# EAGLE design Programmer (EAGLE 7.1.0)
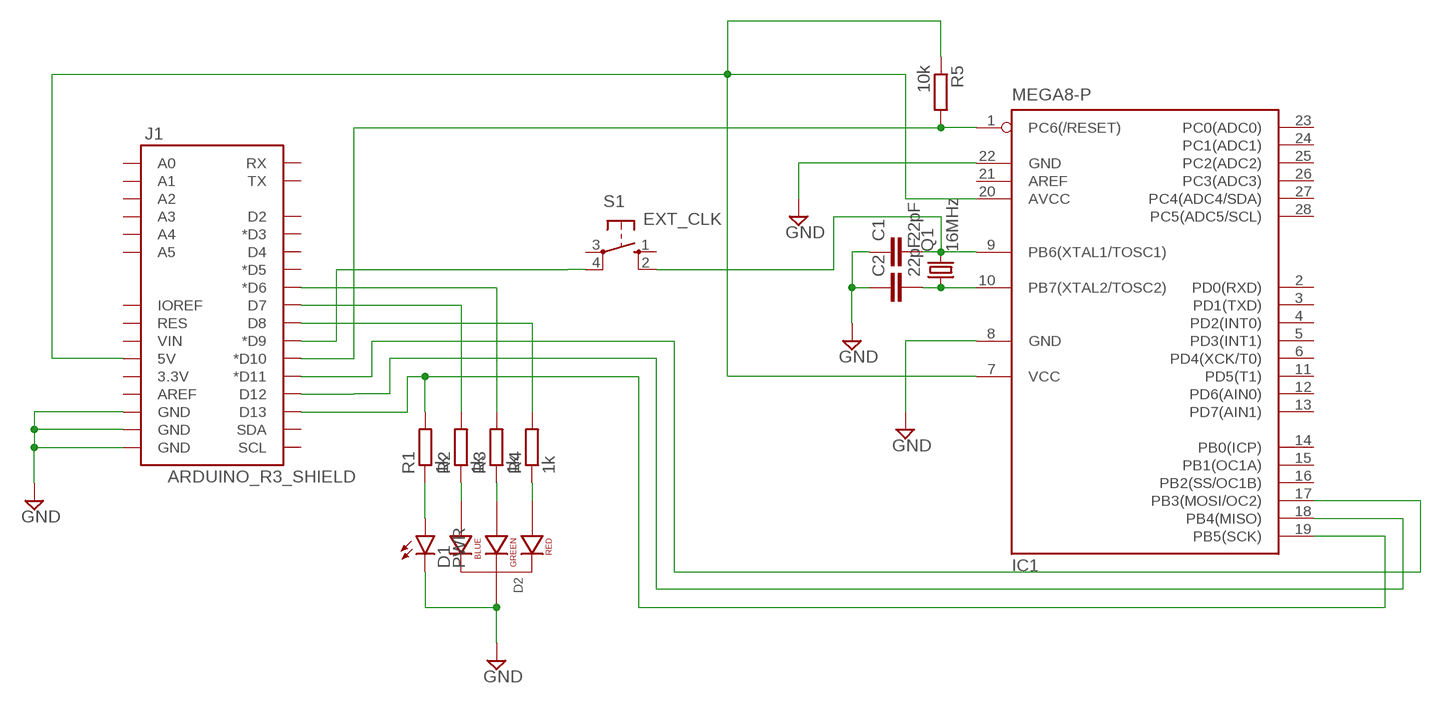
[diagram p0: schematic, sheet 1]

## Parts
C1  22pF  C5/2.5  [C5B2.5]
C2  22pF  C5/2.5  [C5B2.5]
D1  PWR  LED3MM  [LED3MM]
D2  LED-RGB-CC-THRUCLEAR  [LED-RGB-THRU]
IC1  MEGA8-P  [DIL28-3]
J1  ARDUINO_R3_SHIELD  [UNO_R3_SHIELD]
Q1  16MHz  CRYSTALHC49S  [HC49/S]
R1  1k  R-EU_0207_2V  [0207/2V]
R2  1k  R-EU_0207_2V  [0207/2V]
R3  1k  R-EU_0207_2V  [0207/2V]
R4  1k  R-EU_0207_2V  [0207/2V]
R5  10k  R-EU_0207_2V  [0207/2V]
S1  EXT_CLK  10-XX  [B3F-10XX]

## Nets
GND: C1.1 C2.1 D1.K(C) D2.2(CATHODE) IC1.8(GND) IC1.22(GND) J1.GND@0(GND) J1.GND@1(GND) J1.GND@2(GND)
N$1: C1.2 IC1.9(PB6(XTAL1/TOSC1)) Q1.2 S1.2(S1)
N$2: D2.1(RED_CATHODE) R4.1
N$3: C2.2 IC1.10(PB7(XTAL2/TOSC2)) Q1.1
N$4: D1.A R1.1
N$5: D2.4(BLUE_CATHODE) R2.1
N$6: D2.3(GREEN_CATHODE) R3.1
N$7: J1.D6(*D6) R3.2
N$8: J1.D8 R4.2
N$9: J1.D7 R2.2
N$10: IC1.19(PB5(SCK)) J1.D13 R1.2
N$15: IC1.1(PC6(/RESET)) J1.D10(*D10) R5.2
N$18: IC1.18(PB4(MISO)) J1.D12
N$20: IC1.17(PB3(MOSI/OC2)) J1.D11(*D11)
N$21: J1.D9(*D9) S1.4(P1)
VCC: IC1.7(VCC) IC1.20(AVCC) J1.5V R5.1
Unconnected: IC1.2(PD0(RXD)) IC1.3(PD1(TXD)) IC1.4(PD2(INT0)) IC1.5(PD3(INT1)) IC1.6(PD4(XCK/T0)) IC1.11(PD5(T1)) IC1.12(PD6(AIN0)) IC1.13(PD7(AIN1)) IC1.14(PB0(ICP)) IC1.15(PB1(OC1A)) IC1.16(PB2(SS/OC1B)) IC1.21(AREF) IC1.23(PC0(ADC0)) IC1.24(PC1(ADC1)) IC1.25(PC2(ADC2)) IC1.26(PC3(ADC3)) IC1.27(PC4(ADC4/SDA)) IC1.28(PC5(ADC5/SCL)) J1.3.3V J1.A0 J1.A1 J1.A2 J1.A3 J1.A4 J1.A5 J1.AREF J1.D2 J1.D3(*D3) J1.D4 J1.D5(*D5) J1.IOREF J1.RES J1.RX J1.SCL J1.SDA J1.TX J1.VIN S1.1(S) S1.3(P)

## Library data of the parts
C1 C2 = capacitor-wima:C: CAPACITOR naming: grid - package width
D1 = SparkFun-LED:LED: LEDs Standard schematic elements and footprints for 5mm, 3mm, 1206, and 0603 sized LEDs. 5mm - Spark Fun Electronics SKU : COM-00529 (and others)
D2 = SparkFun-LED:LED-RGB-CC-THRU: RGB Through-hole common cathode LED SparkFun Storefront: COM-00105 (Clear) COM-09264 (Diffuse); PROD_ID: DIO-08418
IC1 = atmel:MEGA8-P: MICROCONTROLLER 8 Kbytes FLASH, 1 kbytes SRAM, 512 bytes EEPROM, USART, 4-channel 10 bit ADC, 2-channel 8 bit ADC Pin compatible with Atmega48, ATMega88, ATMega168 Source: avr.lbr; OC_FARNELL: unknown; OC_NEWARK: unknown
J1 = SparkFun-Boards:ARDUINO_R3_SHIELD: Shield form compatible with the Arduino Uno R3.
Q1 = crystal:CRYSTAL: CRYSTAL; OC_FARNELL: 1667008; OC_NEWARK: unknown
R1-R5 = resistor:R-EU_: RESISTOR, European symbol; SPICEPREFIX: R
S1 = switch-omron:10-XX: OMRON SWITCH; MPN: B3F-1000; OC_FARNELL: 176432; OC_NEWARK: 36M3542

## Board
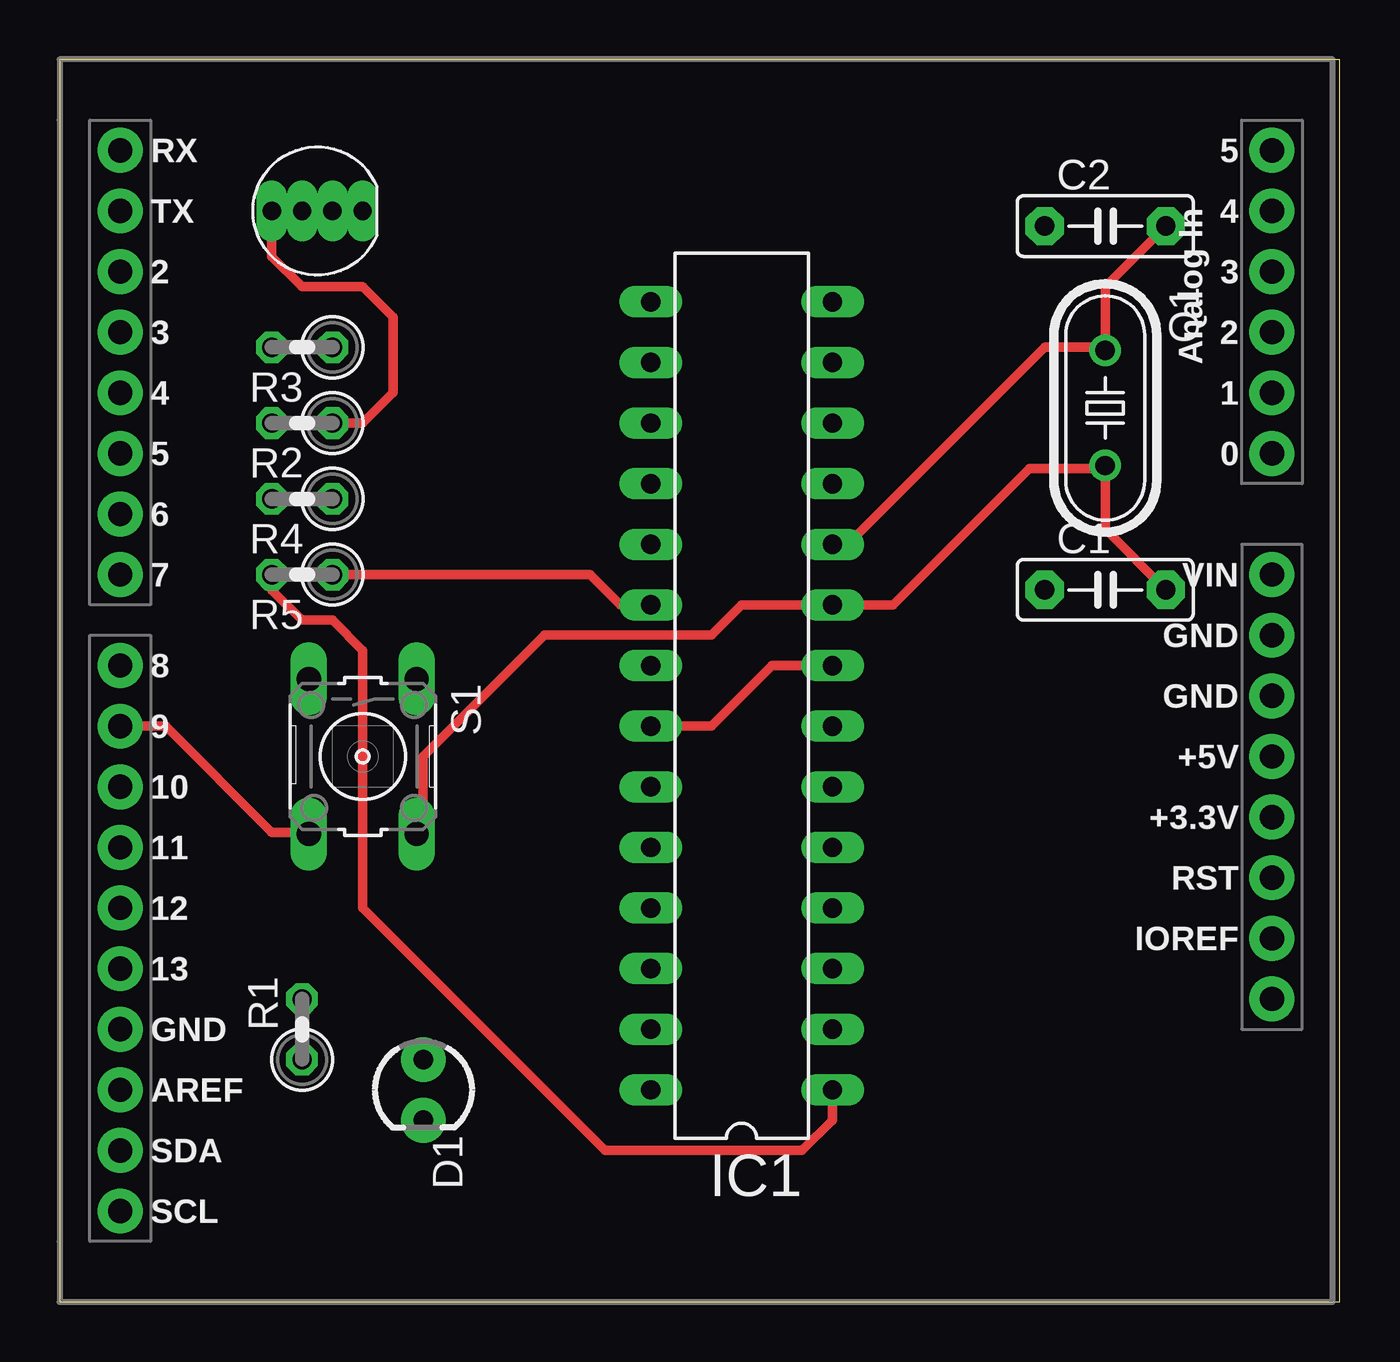
[diagram p1: board, top side]
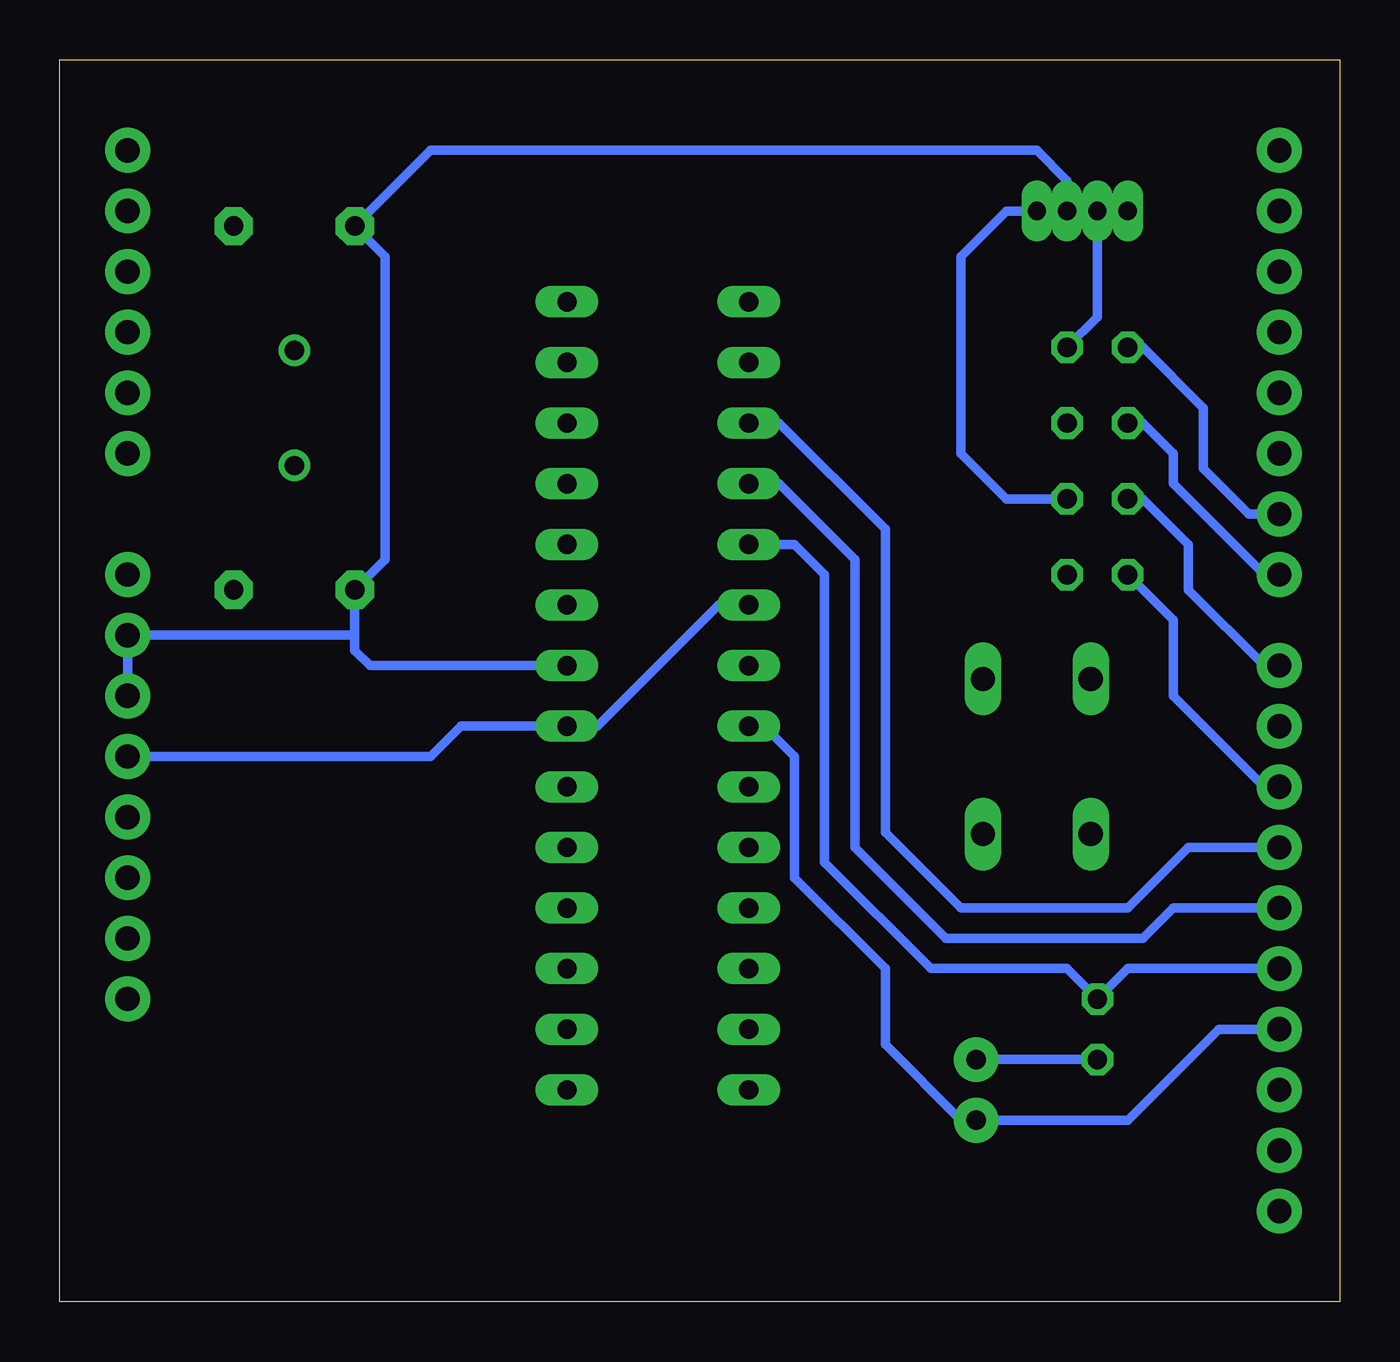
[diagram p2: board, bottom side, seen from below]

Size 53.65 x 52.06 mm. Coordinates in mm from the lower left corner, seen from the top.
Outline: 0,0 53.65,0 53.65,52.06 0,52.06 0,0
Copper layers (1*16): Top 0.035mm / dielectric 1.5mm / Bottom 0.035mm
Design rules "default": minimum track width 10mil, minimum drill 24mil, track to track 8mil, track to pad 8mil, pad to pad 8mil, via to via 8mil, smd to smd 8mil, copper to edge 40mil, drill to drill 8mil, minimum pad ring 10mil, minimum via ring 8mil, stop-mask expansion 4mil, vias tented up to drill 0mil, thermal gap 10mil

### Footprints (pad centres in the part's own frame; a part is rotated, then mirrored left to right if it is on the bottom)
C5B2.5 = drill 0.813 pad 1.6 octagon: 1 -2.54,0; 2 2.54,0
LED3MM = drill 0.813 pad 1.88: A -1.27,0; K 1.27,0
LED-RGB-THRU = drill 0.762 pad 0.889 long: 1 1.905,0; 2 0.635,0; 3 -0.635,0; 4 -1.905,0
DIL28-3 = drill 0.813 long: 1 -16.51,-3.81; 2 -13.97,-3.81; 3 -11.43,-3.81; 4 -8.89,-3.81; 5 -6.35,-3.81; 6 -3.81,-3.81; 7 -1.27,-3.81; 8 1.27,-3.81; 9 3.81,-3.81; 10 6.35,-3.81; 11 8.89,-3.81; 12 11.43,-3.81; 13 13.97,-3.81; 14 16.51,-3.81; 15 16.51,3.81; 16 13.97,3.81; 17 11.43,3.81; 18 8.89,3.81; 19 6.35,3.81; 20 3.81,3.81; 21 1.27,3.81; 22 -1.27,3.81; 23 -3.81,3.81; 24 -6.35,3.81; 25 -8.89,3.81; 26 -11.43,3.81; 27 -13.97,3.81; 28 -16.51,3.81
UNO_R3_SHIELD = drill 1.016 pad 1.88: 3.3V 50.8,20.32; 5V 50.8,22.86; A0 50.8,35.56; A1 50.8,38.1; A2 50.8,40.64; A3 50.8,43.18; A4 50.8,45.72; A5 50.8,48.26; AREF 2.54,8.89; D2 2.54,43.18; D3 2.54,40.64; D4 2.54,38.1; D5 2.54,35.56; D6 2.54,33.02; D7 2.54,30.48; D8 2.54,26.67; D9 2.54,24.13; D10 2.54,21.59; D11 2.54,19.05; D12 2.54,16.51; D13 2.54,13.97; GND@0 50.8,25.4; GND@1 50.8,27.94; GND@2 2.54,11.43; IOREF 50.8,15.24; NC 50.8,12.7; RES 50.8,17.78; RX 2.54,48.26; SCL 2.54,3.81; SDA 2.54,6.35; TX 2.54,45.72; VIN 50.8,30.48
HC49/S = drill 0.813: 1 -2.413,0; 2 2.413,0
0207/2V = drill 0.813 octagon: 1 -1.27,0; 2 1.27,0
B3F-10XX = drill 1.016 long: 1 -3.251,2.261; 2 3.251,2.261; 3 -3.251,-2.261; 4 3.251,-2.261

### Placement (x,y rotation side)
C1  43.81,29.84 0 top
C2  43.81,45.09 0 top
D1  15.24,8.89 270 top
D2  10.79,45.72 0 top
IC1  28.57,25.4 90 top
J1  0,0 0 top
Q1  43.81,37.47 270 top
R1  10.16,11.43 90 top
R2  10.16,36.83 180 top
R3  10.16,40.01 180 top
R4  10.16,33.66 180 top
R5  10.16,30.48 180 top
S1  12.7,22.86 270 top

### Tracks (layer width: path | path; a pad name or v marks a point on that pad's centre or on a via)
GND
  Top 0.406: IC1.8 29.84,26.67 27.3,24.13 IC1.22
  Bottom 0.406: J1.GND@0 J1.GND@1 41.27,27.94 | 41.27,27.94 C1.1 40.01,31.11 40.01,43.81 C2.1 38.1,48.26 12.7,48.26 11.43,46.99 D2.2 | 41.27,27.94 41.27,27.3 40.64,26.67 IC1.8 | IC1.22 24.13,24.13 22.86,22.86 22.86,17.78 19.05,13.97 19.05,10.79 15.88,7.62 D1.K 8.89,7.62 5.08,11.43 J1.GND@2
N$1
  Top 0.406: S1.2 15.24,19.89 15.24,22.86 20.32,27.94 27.3,27.94 28.57,29.21 IC1.9 34.92,29.21 40.64,34.92 43.69,34.92 Q1.2 43.81,32.38 C1.2
N$2
  Bottom 0.406: D2.1 13.97,45.72 15.88,43.81 15.88,35.56 13.97,33.66 R4.1
N$3
  Top 0.406: IC1.10 33.02,31.75 41.27,40.01 43.69,40.01 Q1.1 43.81,42.55 C2.2
N$4
  Bottom 0.406: R1.1 13.97,10.16 D1.A
N$5
  Top 0.406: D2.4 8.89,43.81 10.16,42.55 12.7,42.55 13.97,41.27 13.97,38.1 12.7,36.83 R2.1
N$6
  Bottom 0.406: D2.3 10.16,41.27 R3.1
N$7
  Bottom 0.406: R3.2 8.26,40.01 5.71,37.47 5.71,34.92 3.81,33.02 J1.D6
N$8
  Bottom 0.406: R4.2 8.26,33.66 6.35,31.75 6.35,29.84 3.17,26.67 J1.D8
N$9
  Bottom 0.406: R2.2 8.26,36.83 6.99,35.56 6.99,34.29 5.08,32.38 3.17,30.48 J1.D7
N$10
  Bottom 0.406: IC1.19 22.86,31.75 21.59,30.48 21.59,18.41 17.14,13.97 11.43,13.97 R1.2 8.89,13.97 J1.D13
N$15
  Top 0.406: R5.2 8.89,29.84 10.16,28.57 11.43,28.57 12.7,27.3 12.7,16.51 22.86,6.35 31.11,6.35 32.38,7.62 IC1.1
  Bottom 0.406: J1.D10 3.17,21.59 6.99,25.4 6.99,28.57 R5.2
N$18
  Bottom 0.406: J1.D12 6.99,16.51 8.26,15.24 16.51,15.24 20.32,19.05 20.32,31.11 23.5,34.29 IC1.18
N$20
  Bottom 0.406: J1.D11 6.35,19.05 8.89,16.51 15.88,16.51 19.05,19.68 19.05,32.38 23.5,36.83 IC1.17
N$21
  Top 0.406: J1.D9 4.45,24.13 8.89,19.68 10.36,19.68 S1.4
VCC
  Top 0.406: R5.1 22.23,30.48 23.5,29.21 IC1.20
  Bottom 0.406: IC1.20 26.04,29.21 31.11,24.13 IC1.7 36.83,24.13 38.1,22.86 J1.5V